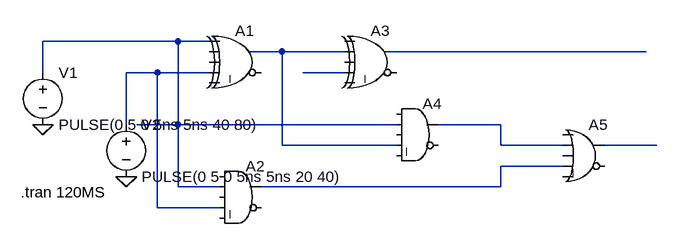
[diagram p0: schematic Fulladdr.asc]
Fulladdr.asc, the LTspice schematic file:
Version 4
SHEET 1 1012 680
WIRE 272 32 64 32
WIRE 320 32 272 32
WIRE 432 48 384 48
WIRE 528 48 432 48
WIRE 992 48 592 48
WIRE 64 80 64 32
WIRE 240 80 192 80
WIRE 320 80 240 80
WIRE 528 80 464 80
WIRE 192 160 192 80
WIRE 272 160 272 32
WIRE 272 160 208 160
WIRE 608 160 272 160
WIRE 768 160 672 160
WIRE 432 192 432 48
WIRE 608 192 432 192
WIRE 768 192 768 160
WIRE 864 192 768 192
WIRE 1008 192 928 192
WIRE 864 224 768 224
WIRE 272 256 272 160
WIRE 336 256 272 256
WIRE 768 256 768 224
WIRE 768 256 400 256
WIRE 240 288 240 80
WIRE 336 288 240 288
FLAG 192 240 0
FLAG 64 160 0
SYMBOL voltage 64 64 R0
WINDOW 123 0 0 Left 0
WINDOW 39 0 0 Left 0
SYMATTR InstName V1
SYMATTR Value PULSE(0 5 0 5ns 5ns 40 80)
SYMBOL voltage 192 144 R0
WINDOW 123 0 0 Left 0
WINDOW 39 0 0 Left 0
SYMATTR InstName V2
SYMATTR Value PULSE(0 5 0 5ns 5ns 20 40)
SYMBOL Digital\\xor 368 0 R0
SYMATTR InstName A1
SYMBOL Digital\\xor 576 0 R0
SYMATTR InstName A3
SYMBOL Digital\\and 640 112 R0
SYMATTR InstName A4
SYMBOL Digital\\or 896 144 R0
SYMATTR InstName A5
SYMBOL Digital\\and 368 208 R0
SYMATTR InstName A2
TEXT 30 264 Left 2 !.tran 120MS

The netlist it stands for:
* Fulladdr.asc
V1 N001 0 PULSE(0 5 0 5ns 5ns 40 80)
V2 N004 0 PULSE(0 5 0 5ns 5ns 20 40)
A1 N001 0 0 N004 0 0 N002 0 XOR
A3 0 N002 0 N005 0 0 N003 0 XOR
A4 0 N001 0 N002 0 0 N006 0 AND
A5 0 N006 0 N008 0 0 N007 0 OR
A2 0 N001 0 N004 0 0 N008 0 AND
.tran 120MS
.backanno
.end